# EAGLE design ltc2344-16 (EAGLE 9.5.1)
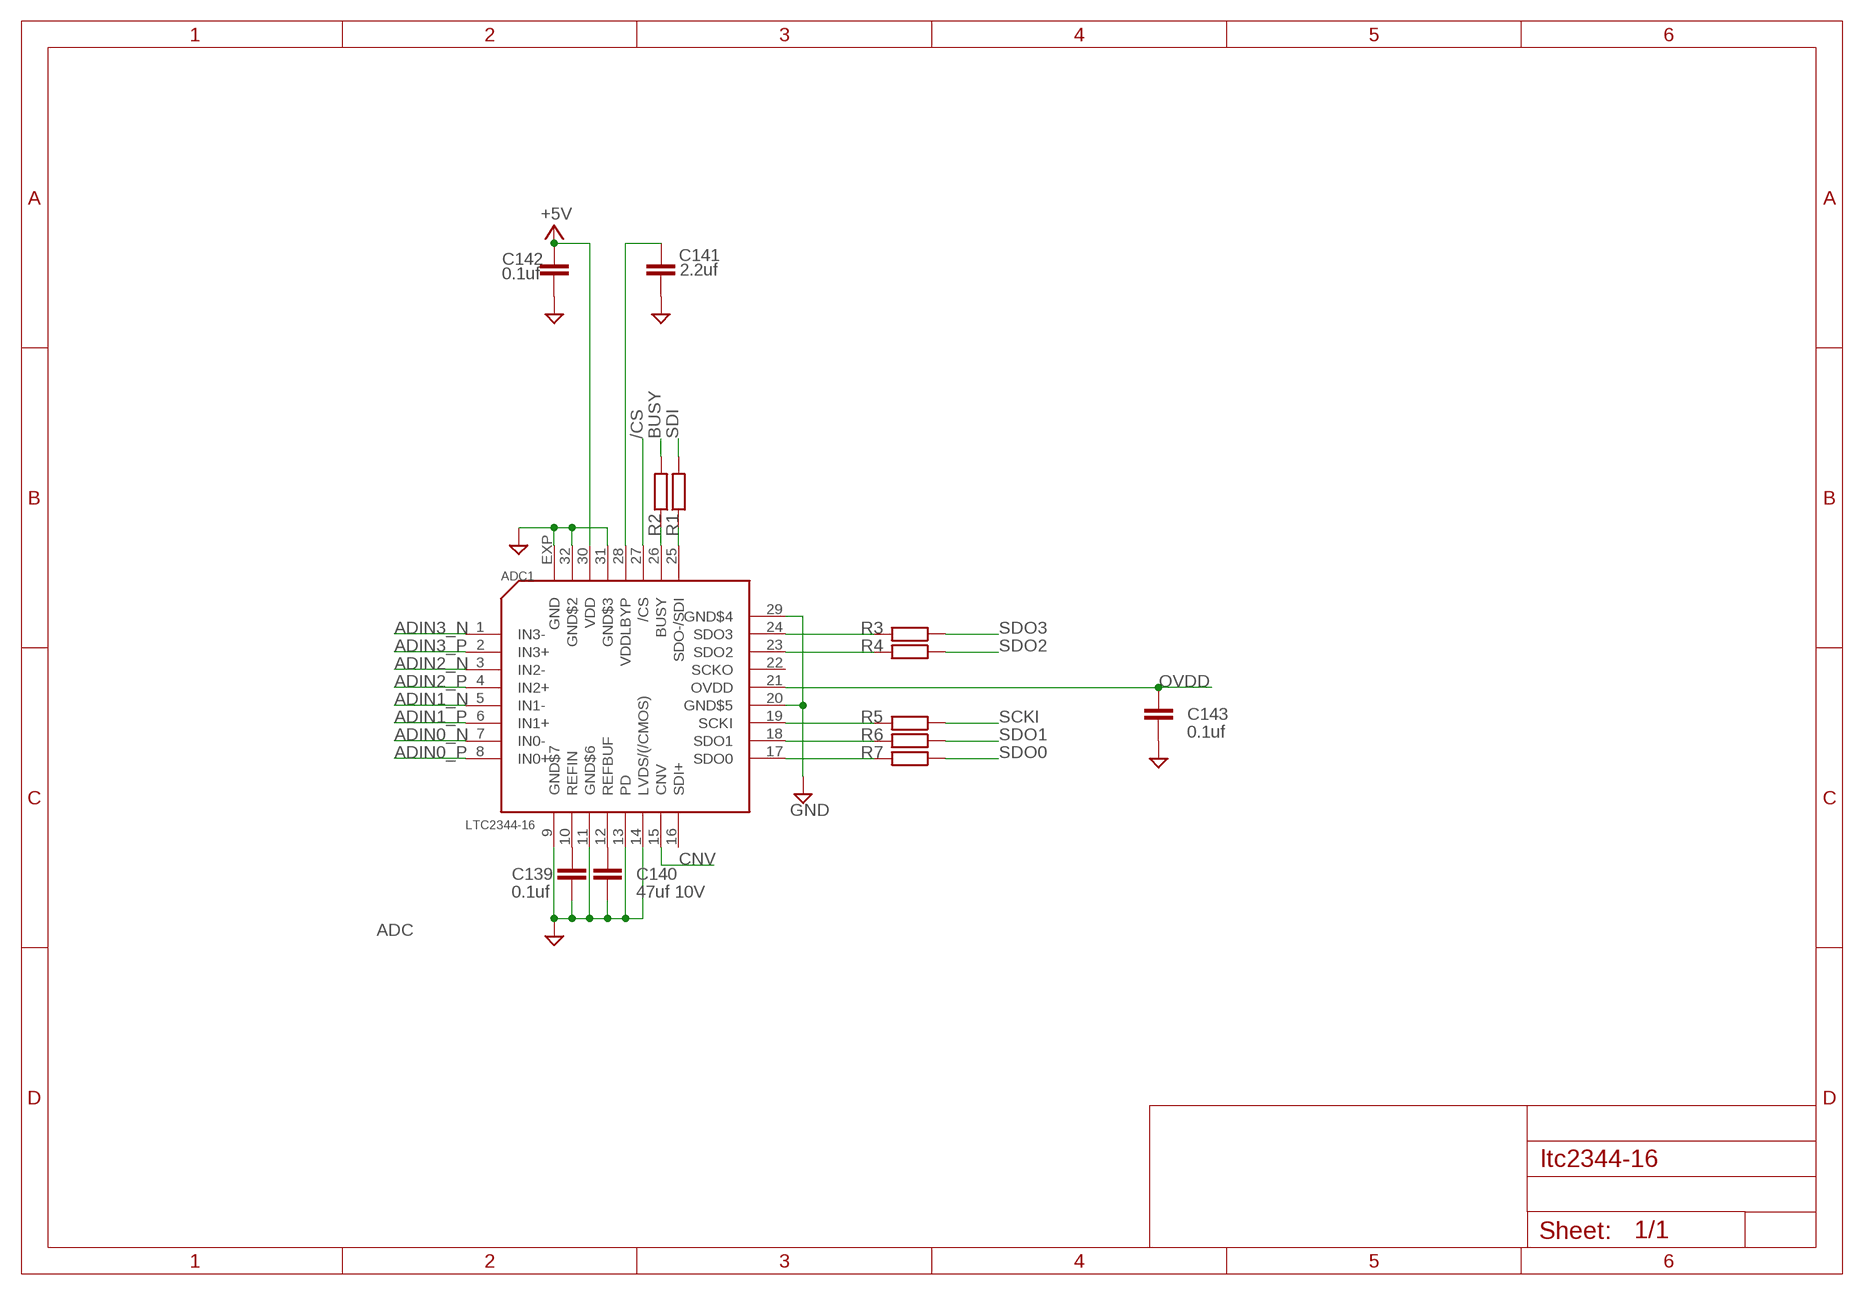
[diagram p0: schematic, sheet 1]

## Parts
ADC1  LTC2344-16  [QFN32]
C139  0.1uf  C-EUC0402  [C0402]
C140  47uf 10V  C-EUC1210  [C1210]
C141  2.2uf  C-EUC0402  [C0402]
C142  0.1uf  C-EUC0402  [C0402]
C143  0.1uf  C-EUC0402  [C0402]
R1  33R  R-EU_R0402  [R0402]
R2  33R  R-EU_R0402  [R0402]
R3  33R  R-EU_R0402  [R0402]
R4  33R  R-EU_R0402  [R0402]
R5  33R  R-EU_R0402  [R0402]
R6  33R  R-EU_R0402  [R0402]
R7  33R  R-EU_R0402  [R0402]

## Nets
+5V: ADC1.30(VDD) C142.1
/CS: ADC1.27(/CS)
ADIN0_N: ADC1.7(IN0-)
ADIN0_P: ADC1.8(IN0+)
ADIN1_N: ADC1.5(IN1-)
ADIN1_P: ADC1.6(IN1+)
ADIN2_N: ADC1.3(IN2-)
ADIN2_P: ADC1.4(IN2+)
ADIN3_N: ADC1.1(IN3-)
ADIN3_P: ADC1.2(IN3+)
BUSY: R2.2
CNV: ADC1.15(CNV)
GND [power]: ADC1.9(GND$7) ADC1.11(GND$6) ADC1.13(PD) ADC1.14(LVDS/(/CMOS)) ADC1.20(GND$5) ADC1.29(GND$4) ADC1.31(GND$3) ADC1.32(GND$2) ADC1.EXP(GND) C139.2 C140.2 C141.2 C142.2 C143.2
N1: ADC1.26(BUSY) R2.1
N2: ADC1.25(SDO-/SDI) R1.1
N$1: ADC1.24(SDO3) R3.2
N$2: ADC1.23(SDO2) R4.2
N$3: ADC1.19(SCKI) R5.2
N$4: ADC1.18(SDO1) R6.2
N$5: ADC1.17(SDO0) R7.2
N$81: ADC1.10(REFIN) C139.1
N$82: ADC1.12(REFBUF) C140.1
N$83: ADC1.28(VDDLBYP) C141.1
OVDD: ADC1.21(OVDD) C143.1
SCKI: R5.1
SDI: R1.2
SDO0: R7.1
SDO1: R6.1
SDO2: R4.1
SDO3: R3.1
Unconnected: ADC1.16(SDI+) ADC1.22(SCKO)

## Notes on the sheet
- ADC

## Library data of the parts
ADC1 = wouter:LTC2344-16
C139-C143 = rcl:C-EU: CAPACITOR, European symbol; SPICEPREFIX: C
R1-R7 = rcl:R-EU_: RESISTOR, European symbol; SPICEPREFIX: R

## Board
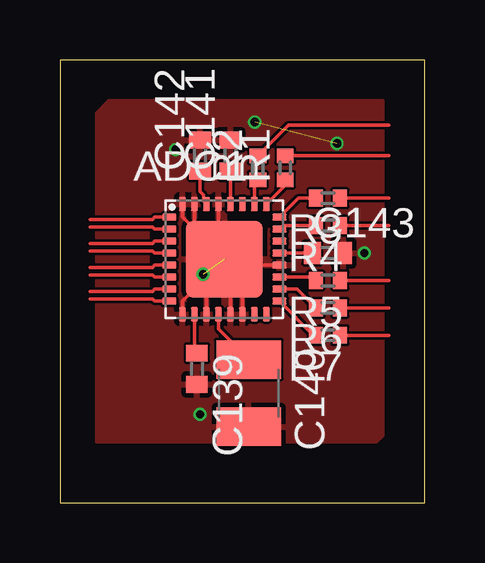
[diagram p1: board, top side]

Size 15.22 x 18.47 mm. Coordinates in mm from the lower left corner, seen from the top.
Outline: 0,0 15.22,0 15.22,18.47 0,18.47 0,0
Copper layers (1+2*3+16): Top 0.012mm / dielectric 0.36mm / Route2 0.018mm / dielectric 0.71mm / Route3 0.018mm / dielectric 0.36mm / Bottom 0.012mm
Design rules "eC_4Layer_PClass8_BaseCopperO12-I18": minimum track width 0.1mm, minimum drill 0.25mm, track to track 0.1mm, track to pad 0.1mm, pad to pad 0.1mm, via to via 0.1mm, smd to smd 0mil, copper to edge 0.25mm, drill to drill 0.35mm, minimum pad ring 0.15mm, minimum via ring 0.1mm, stop-mask expansion 0mil, vias tented up to drill 0.45mm, thermal gap 0.2mm

### Footprints (pad centres in the part's own frame; a part is rotated, then mirrored left to right if it is on the bottom)
QFN32 = smd 0.6 x 0.3: 1 -2.3,1.75; 2 -2.3,1.25; 3 -2.3,0.75; 4 -2.3,0.25; 5 -2.3,-0.25; 6 -2.3,-0.75; 7 -2.3,-1.25; 8 -2.3,-1.75; 17 2.3,-1.75; 18 2.3,-1.25; 19 2.3,-0.75; 20 2.3,-0.25; 21 2.3,0.25; 22 2.3,0.75; 23 2.3,1.25; 24 2.3,1.75 | smd 0.3 x 0.6: 9 -1.75,-2.3; 10 -1.25,-2.3; 11 -0.75,-2.3; 12 -0.25,-2.3; 13 0.25,-2.3; 14 0.75,-2.3; 15 1.25,-2.3; 16 1.75,-2.3; 25 1.75,2.3; 26 1.25,2.3; 27 0.75,2.3; 28 0.25,2.3; 29 -0.25,2.3; 30 -0.75,2.3; 31 -1.25,2.3; 32 -1.75,2.3 | smd 3.2 x 3.2: EXP 0,0
C0402 = smd 0.7 x 0.9: 1 -0.65,0; 2 0.65,0
C1210 = smd 1.6 x 2.7: 1 -1.4,0; 2 1.4,0
R0402 = smd 0.6 x 0.7: 1 -0.5,0; 2 0.5,0

### Placement (x,y rotation side)
ADC1  6.86,10.16 0 top
C139  5.71,5.59 270 top
C140  7.87,4.57 270 top
C141  7.11,14.48 90 top
C142  5.84,14.48 90 top
C143  11.18,10.41 0 top
R1  9.4,13.97 90 top
R2  8.26,13.97 90 top
R3  11.18,12.7 180 top
R4  11.18,11.56 180 top
R5  11.18,9.27 180 top
R6  11.18,8.13 180 top
R7  11.18,6.99 180 top

### Tracks (layer width: path | path; a pad name or v marks a point on that pad's centre or on a via)
+5V
  Top 0.152: ADC1.30 5.99,12.58 5.99,12.83 5.84,12.97 C142.1
ADIN0_N
  Top 0.152: ADC1.7 3.95,8.91 3.86,8.81 1.27,8.81
ADIN0_P
  Top 0.152: ADC1.8 3.95,8.41 3.86,8.51 1.27,8.51
ADIN1_N
  Top 0.152: ADC1.5 3.95,9.91 3.86,9.81 1.27,9.81
ADIN1_P
  Top 0.152: ADC1.6 3.95,9.41 3.86,9.51 1.27,9.51
ADIN2_N
  Top 0.152: ADC1.3 3.95,10.91 3.86,10.81 1.27,10.81
ADIN2_P
  Top 0.152: ADC1.4 3.95,10.41 3.86,10.51 1.27,10.51
ADIN3_N
  Top 0.152: ADC1.1 3.95,11.91 3.86,11.81 1.27,11.81
ADIN3_P
  Top 0.152: ADC1.2 3.95,11.41 3.86,11.51 1.27,11.51
BUSY
  Top 0.152: R2.2 9.53,15.75 13.72,15.75
GND  (via drill 0.35)  (2 unrouted)
  Top 0.152: C140.2 7.87,2.56 | ADC1.29 6.61,10.41 ADC1.EXP | ADC1.31 5.61,11.41 ADC1.EXP | ADC1.32 5.11,11.91 ADC1.EXP | ADC1.13 7.11,9.91 | ADC1.14 7.61,9.41 ADC1.EXP | ADC1.11 6.11,9.41 ADC1.EXP | ADC1.9 5.11,8.41 ADC1.EXP | ADC1.20 7.11,9.91 | 7.11,9.91 ADC1.EXP
  other vias: 5.97,9.53 5.84,3.68 8.13,15.88 4.83,14.73 12.7,10.41 11.56,14.99
  pour Top: 1.52,16.26 1.52,2.54 13.21,2.54 13.46,2.79 13.46,16.76 2.03,16.76
  pour Top: 1.52,11.3 1.52,11.05 3.68,11.05 3.68,11.3
  pour Top: 1.52,10.29 1.52,10.03 3.68,10.03 3.68,10.29
  pour Top: 1.52,9.27 1.52,9.02 3.68,9.02 3.68,9.27
N1
  Top 0.152: ADC1.26 8.11,13.32 R2.1
N2
  Top 0.152: ADC1.25 9.4,13.25 R1.1
N$1
  Top 0.152: ADC1.24 9.95,12.7 R3.2
N$2
  Top 0.152: ADC1.23 9.3,11.56 R4.2
N$3
  Top 0.152: ADC1.19 10.54,9.41 R5.2
N$4
  Top 0.152: ADC1.18 9.89,8.91 R6.2
N$5
  Top 0.152: ADC1.17 10.58,6.99 R7.2
N$81
  Top 0.152: ADC1.10 5.61,6.34 C139.1
N$82
  Top 0.152: ADC1.12 6.61,7.24 C140.1
N$83
  Top 0.152: C141.1 ADC1.28
OVDD
  Top 0.152: ADC1.21 C143.1
SCKI
  Top 0.152: R5.1 13.72,9.27
SDI
  Top 0.152: R1.2 13.72,14.48
SDO0
  Top 0.152: R7.1 13.72,6.99
SDO1
  Top 0.152: R6.1 13.72,8.13
SDO2
  Top 0.152: R4.1 13.72,11.56
SDO3
  Top 0.152: R3.1 13.72,12.7